# Altium project PI3.PrjPcb
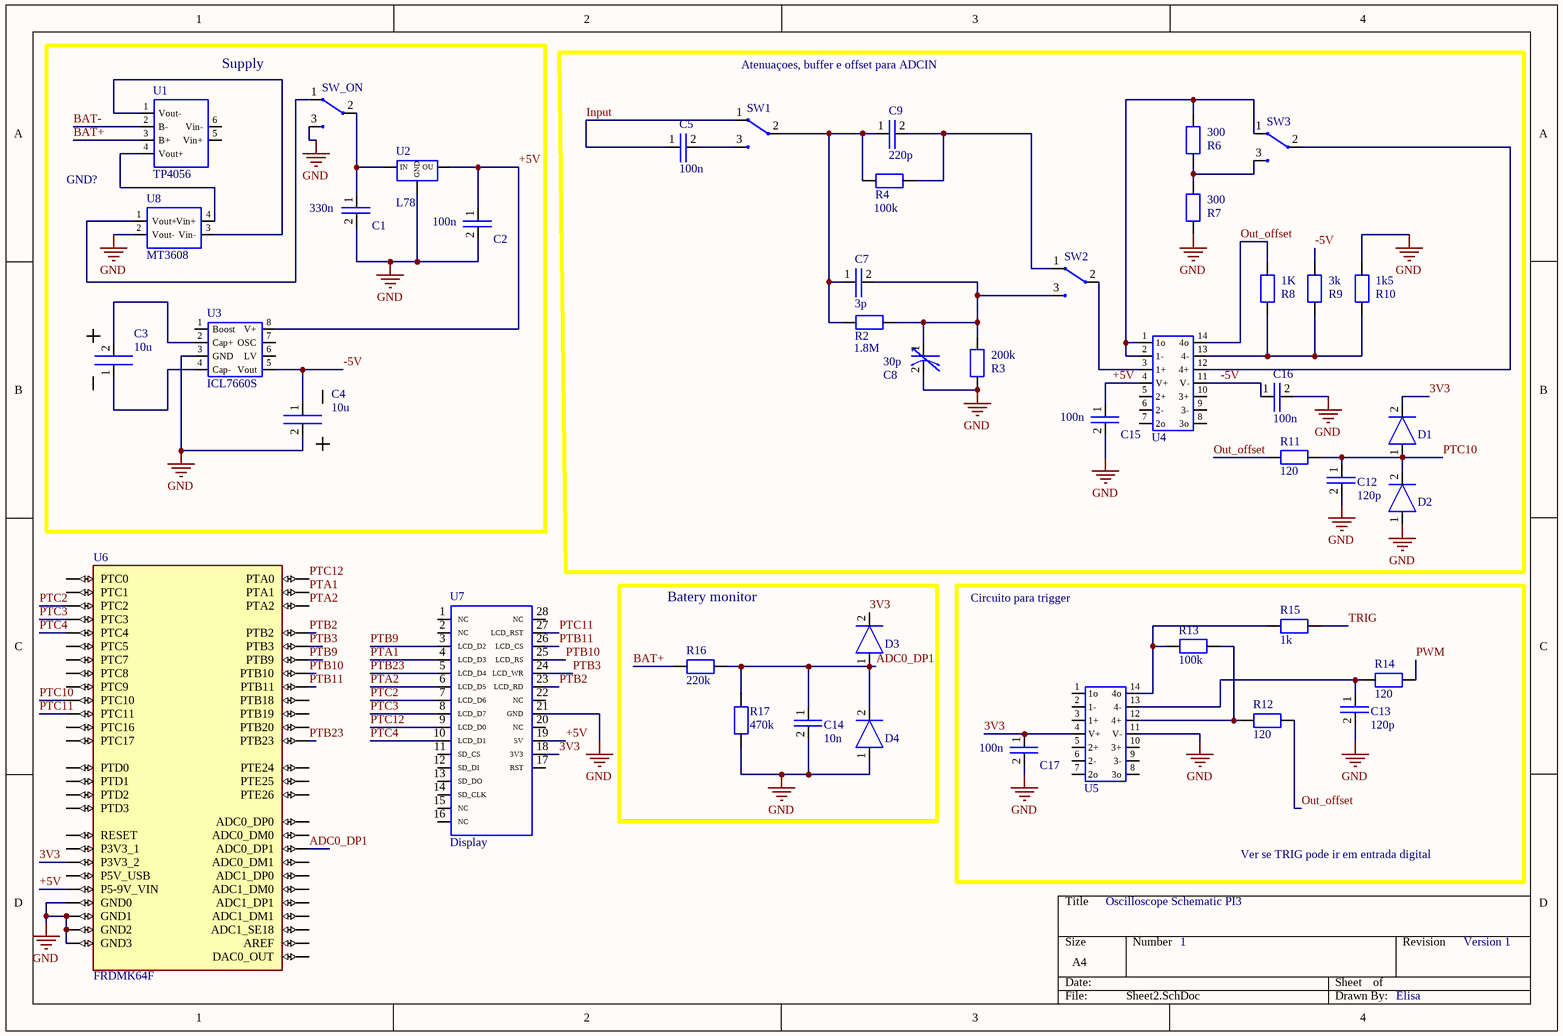
[diagram p0: Sheet2.SchDoc]
1 sheet, 45 parts. Net scope: global (net labels, ports and power ports of the same name join across sheets).
Board file: PCB1.PcbDoc

## Sheet Sheet2.SchDoc
size A4; SheetNumber: 1; SheetTotal: 1

### Parts
C1  330n  [CAP_CER_THT]
C2  100n  [CAP_CER_THT]
C3  10u  [CAP_THT]
C4  10u  [CAP_THT]
C5  100n  [CAP_CER_THT]
C7  3p  [CAP_CER_THT]
C8  30p  [CAP_TRIMM_THT]
C9  220p  [CAP_CER_THT]
C12  120p  [CAP_CER_THT]
C13  120p  [CAP_CER_THT]
C14  10n  [CAP_CER_THT]
C15  100n  [CAP_CER_THT]
C16  100n  [CAP_CER_THT]
C17  100n  [CAP_CER_THT]
D1  diode_1N4148  [SOD323F_DIODE]  (value not drawn)
D2  diode_1N4148  [SOD323F_DIODE]  (value not drawn)
D3  diode_1N4148  [SOD323F_DIODE]  (value not drawn)
D4  diode_1N4148  [SOD323F_DIODE]  (value not drawn)
R2  1.8M  [RES_THT]
R3  200k  [RES_THT]
R4  100k  [RES_THT]
R6  300  [RES_THT]
R7  300  [RES_THT]
R8  1K  [RES_THT]
R9  3k  [RES_THT]
R10  1k5  [RES_THT]
R11  120  [RES_THT]
R12  120  [RES_THT]
R13  100k  [RES_THT]
R14  120  [RES_THT]
R15  1k  [RES_THT]
R16  220k  [RES_THT]
R17  470k  [RES_THT]
SW1  SW  [SW]  (value not drawn)
SW2  SW  [SW]  (value not drawn)
SW3  SW  [SW]  (value not drawn)
SW_ON  SW  [SW]  (value not drawn)
U1  TP4056  [TP0456]
U2  L78  [TO-220-3]
U3  ICL7660S  [8 -PDIP]
U4  TL084CN  [14-PDIP]  (value not drawn)
U5  TL084CN  [14-PDIP]  (value not drawn)
U6  FRDMK64F  [FRDMK64F]
U7  Display  [Display]
U8  MT3608  [MT3608]

### Blocks framed on the sheet
Supply: C1-C4 SW_ON U1-U3 U8
Atenuaçoes, buffer e offset para ADCIN: C5 C7-C9 C12 C15 C16 D1 D2 R2-R4 R6-R11 SW1-SW3 U4
Batery monitor: C14 D3 D4 R16 R17

### Nets
GND: C1.2 C2.2 C4.2 C8.2 C12.2 C13.2 C14.2 C15.2 C16.2 C17.2 D2.1 D4.1 R3.1 R7.1 R10.2 R17.2 SW_ON.3 U2.2(GND) U3.3(GND) U5.11(V-) U6.J2-3(GND0) U6.J2-14(GND1) U6.J3-12(GND2) U6.J3-14(GND3) U7.21(GND) U8.2(Vout-)
3V3: C17.1 D1.2 D3.2 U5.4(V+) U6.J3-8(P3V3_2) U7.18(3V3)
+5V: C2.1 C15.1 U2.3(OU) U3.8(V+) U4.4(V+) U6.J3-16(P5-9V_VIN) U7.19(5V)
-5V: C4.1 C16.1 R9.2 U3.5(Vout) U4.11(V-)
ADC0_DP1: C14.1 D3.1 D4.2 R16.1 R17.1 U6.J4-1(ADC0_DP1)
BAT+: R16.2 U1.3(B+)
BAT-: U1.2(B-)
Input: C5.1 SW1.1
Out_offset: R8.2 R11.2 R12.1 U4.14(4o)
PTA1: U6.J1-8(PTA1) U7.4(LCD_D3)
PTA2: U6.J1-12(PTA2) U7.6(LCD_D5)
PTB2: U6.J4-2(PTB2) U7.23(LCD_RD)
PTB3: U6.J4-4(PTB3) U7.24(LCD_WR)
PTB9: U6.J1-6(PTB9) U7.3(LCD_D2)
PTB10: U6.J4-6(PTB10) U7.25(LCD_RS)
PTB11: U6.J4-8(PTB11) U7.26(LCD_CS)
PTB23: U6.J1-10(PTB23) U7.5(LCD_D4)
PTC2: U6.J1-14(PTC2) U7.7(LCD_D6)
PTC3: U6.J1-16(PTC3) U7.8(LCD_D7)
PTC4: U6.J2-4(PTC4) U7.10(LCD_D1)
PTC10: C12.1 D1.1 D2.2 R11.1 U6.J4-12(PTC10)
PTC11: U6.J4-10(PTC11) U7.27(LCD_RST)
PTC12: U6.J2-2(PTA0) U7.9(LCD_D0)
PWM: R14.1
TRIG: R15.2
NetC1_1: C1.1 SW_ON.2 U2.1(IN)
NetC3_1: C3.1 U3.4(Cap-)
NetC3_2: C3.2 U3.2(Cap+)
NetC5_2: C5.2 SW1.3
NetC7_1: C7.1 C9.1 R2.1 R4.1 SW1.2
NetC7_2: C7.2 C8.1 R2.2 R3.2 SW2.3
NetC9_2: C9.2 R4.2 SW2.1
NetC13_1: C13.1 R14.2 U5.13(4-)
NetR6_1: R6.1 R7.2 SW3.3
NetR6_2: R6.2 SW3.1 U4.1(1o) U4.2(1-)
NetR8_1: R8.1 R9.1 R10.1 U4.13(4-)
NetR12_2: R12.2 R13.1 U5.12(4+)
NetR13_2: R13.2 R15.1 U5.14(4o)
NetSW2_2: SW2.2 U4.3(1+)
NetSW3_2: SW3.2 U4.12(4+)
NetSW_ON_1: SW_ON.1 U8.1(Vout+)
NetU1_1: U1.1(Vout-) U8.3(Vin-)
NetU1_4: U1.4(Vout+) U8.4(Vin+)

Not connected (* = marked no-connect by the designer): U1 5(Vin+) 6(Vin-); U3 1(Boost) 6(LV) 7(OSC); U4 5(2+) 6(2-) 7(2o) 8(3o) 9(3-) 10(3+); U5 1(1o) 2(1-) 3(1+) 5(2+) 6(2-) 7(2o) 8(3o) 9(3-) 10(3+); U6 J1-1(PTB18) J1-2(PTC16) J1-3(PTB19) J1-4(PTC17) J1-5(PTC1) J1-7(PTC8) J1-9(PTC9) J1-11(PTC0) J1-13(PTC7) J1-15(PTC5) J2-1(PTE26) J2-5(ADC0_DP0) J2-6(PTD0) J2-7(ADC0_DM0) J2-8(PTD2) J2-10(PTD3) J2-11(ADC1_DP0) J2-12(PTD1) J2-13(ADC1_DM0) J2-16(AREF) J2-17(ADC1_SE18) J2-18(PTE25) J2-20(PTE24) J3-4(P3V3_1) J3-6(RESET) J3-10(P5V_USB) J4-3(ADC0_DM1) J4-5(ADC1_DP1) J4-7(ADC1_DM1) J4-9(PTB20) J4-11(DAC0_OUT); U7 1(NC) 2(NC) 11(SD_CS) 12(SD_DI) 13(SD_DO) 14(SD_CLK) 15(NC) 16(NC) 17(RST) 20(NC) 22(NC) 28(NC)

### Notes on the sheet
- GND?
- Circuito para trigger
- Oscilloscope Schematic PI3
- Ver se TRIG pode ir em entrada digital
- 1
- Version 1
- Elisa

### Library data of the parts
C1 C2 C5 C7 C9 C12-C17 = Capacitor_THT
C3 C4 = EEU-FC1E470: CAP ALUM 47UF 20% 25V RADIAL TH
C8 = CAP_TRIMM_THT
R2-R4 R6-R17 = RES_THT
U2 = L7805CDT-TR: IC REG LINEAR 5V 1.5A